# Altium schematic sheet 02_AFE.SchDoc
size Letter
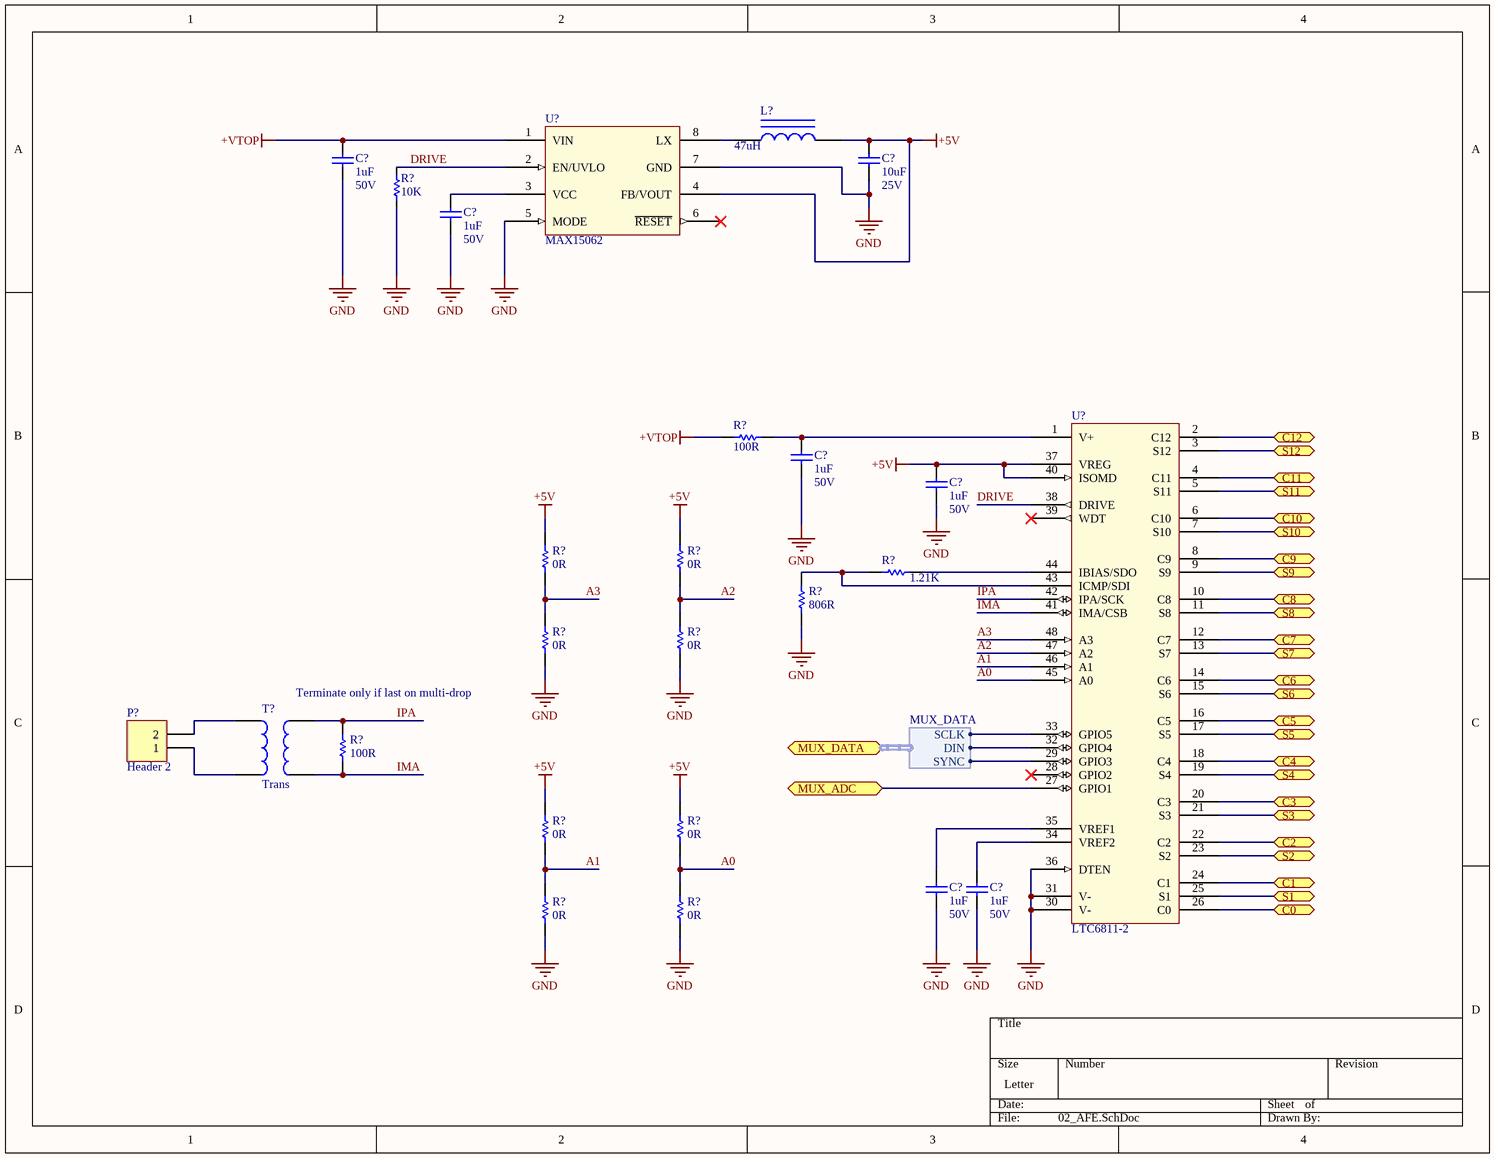
[diagram p0: 02_AFE.SchDoc]

## Parts
(Parts that share a designator on the sheet are numbered #1, #2 ... from top to bottom, then left to right.)
C?#1  1uF  Voltage: 50V  [CAPC1608X06N]
C?#2  10uF  Voltage: 25V  [CAPC1608X06N]
C?#3  1uF  Voltage: 50V  [CAPC1608X06N]
C?#4  1uF  Voltage: 50V  [CAPC1608X06N]
C?#5  1uF  Voltage: 50V  [CAPC1608X06N]
C?#6  1uF  Voltage: 50V  [CAPC1608X06N]
C?#7  1uF  Voltage: 50V  [CAPC1608X06N]
L?  value 47uH  [AXIAL-0.9]  (hidden comment: nductor Iron)
P?  Header 2  [HDR1X2]
R?#1  10K  [0805]
R?#2  value 100R  [AXIAL-0.3]  (hidden comment: Res1)
R?#3  value 0R  [AXIAL-0.3]  (hidden comment: Res1)
R?#4  value 0R  [AXIAL-0.3]  (hidden comment: Res1)
R?#5  value 1.21K  [AXIAL-0.3]  (hidden comment: Res1)
R?#6  value 806R  [AXIAL-0.3]  (hidden comment: Res1)
R?#7  value 0R  [AXIAL-0.3]  (hidden comment: Res1)
R?#8  value 0R  [AXIAL-0.3]  (hidden comment: Res1)
R?#9  value 100R  [AXIAL-0.3]  (hidden comment: Res1)
R?#10  value 0R  [AXIAL-0.3]  (hidden comment: Res1)
R?#11  value 0R  [AXIAL-0.3]  (hidden comment: Res1)
R?#12  value 0R  [AXIAL-0.3]  (hidden comment: Res1)
R?#13  value 0R  [AXIAL-0.3]  (hidden comment: Res1)
T?  Trans  [TRANS]
U?#1  MAX15062
U?#2  LTC6811-2

## Ports
C0, C1, C2, C3, C4, C5, C6, C7, C8, C9, C10, C11, C12, MUX_ADC, MUX_DATA (harness MUX_DATA), S1, S2, S3, S4, S5, S6, S7, S8, S9, S10, S11, S12

## Harnesses
MUX_DATA: SYNC, DIN, SCLK

## Nets
+5V: C?#2.2 C?#5.2 L?.2 R?#3.2 R?#4.2 R?#10.2 R?#11.2 U?#1.4(FB/VOUT) U?#2.37(VREG) U?#2.40(ISOMD)
+VTOP: C?#1.2 R?#2.2 U?#1.1(VIN)
GND: C?#1.1 C?#2.1 C?#3.1 C?#4.1 C?#5.1 C?#6.1 C?#7.1 R?#1.1 R?#6.1 R?#7.1 R?#8.1 R?#12.1 R?#13.1 U?#1.5(MODE) U?#1.7(GND) U?#2.30(V-) U?#2.31(V-) U?#2.36(DTEN)
A0: R?#11.1 R?#13.2 U?#2.45(A0)
A1: R?#10.1 R?#12.2 U?#2.46(A1)
A2: R?#4.1 R?#8.2 U?#2.47(A2)
A3: R?#3.1 R?#7.2 U?#2.48(A3)
C0: U?#2.26(C0) ; port C0
C1: U?#2.24(C1) ; port C1
C2: U?#2.22(C2) ; port C2
C3: U?#2.20(C3) ; port C3
C4: U?#2.18(C4) ; port C4
C5: U?#2.16(C5) ; port C5
C6: U?#2.14(C6) ; port C6
C7: U?#2.12(C7) ; port C7
C8: U?#2.10(C8) ; port C8
C9: U?#2.8(C9) ; port C9
C10: U?#2.6(C10) ; port C10
C11: U?#2.4(C11) ; port C11
C12: U?#2.2(C12) ; port C12
DRIVE: R?#1.2 U?#1.2(EN/UVLO) U?#2.38(DRIVE)
IMA: R?#9.1 T?.4 U?#2.41(IMA/CSB)
IPA: R?#9.2 T?.3 U?#2.42(IPA/SCK)
MUX_ADC: U?#2.27(GPIO1) ; port MUX_ADC
S1: U?#2.25(S1) ; port S1
S2: U?#2.23(S2) ; port S2
S3: U?#2.21(S3) ; port S3
S4: U?#2.19(S4) ; port S4
S5: U?#2.17(S5) ; port S5
S6: U?#2.15(S6) ; port S6
S7: U?#2.13(S7) ; port S7
S8: U?#2.11(S8) ; port S8
S9: U?#2.9(S9) ; port S9
S10: U?#2.7(S10) ; port S10
S11: U?#2.5(S11) ; port S11
S12: U?#2.3(S12) ; port S12
NetC?#3_2: C?#3.2 U?#1.3(VCC)
NetC?#4_2: C?#4.2 R?#2.1 U?#2.1(V+)
NetC?#6_2: C?#6.2 U?#2.35(VREF1)
NetC?#7_2: C?#7.2 U?#2.34(VREF2)
NetL?_1: L?.1 U?#1.8(LX)
NetP?_1: P?.1 T?.2
NetP?_2: P?.2 T?.1
NetR?#5_1: R?#5.1 U?#2.44(IBIAS/SDO)
NetR?#5_2: R?#5.2 R?#6.2 U?#2.43(ICMP/SDI)
NetU?#2_29: U?#2.29(GPIO3) ; port MUX_DATA.SYNC
NetU?#2_32: U?#2.32(GPIO4) ; port MUX_DATA.DIN
NetU?#2_33: U?#2.33(GPIO5) ; port MUX_DATA.SCLK

Not connected (* = marked no-connect by the designer): U?#1 6(~{RESET})*; U?#2 28(GPIO2)* 39(WDT)*

## Notes on the sheet
- Terminate only if last on multi-drop

## Library data of the parts
C?#1 C?#3-C?#7 = CAP CER 1UF 50V 10% X7R 0603: 1µF ±10% 50V Ceramic Capacitor X7R 0603 (1608 Metric); Manufacturer: Taiyo Yuden; ManufacturerPartNumber: UMK107AB7105KA-T; Value: 1uF; Supplier 1: Digi-Key; Supplier Part Number 1: 587-3247-1-ND
C?#2 = CAP CER 10uF 25V 20% X5R 0603: 10µF ±20% 25V Ceramic Capacitor X5R 0603 (1608 Metric); Manufacturer: Murata Electronics North America; ManufacturerPartNumber: GRM188R61E106MA73D; Value: 10uF; Supplier: Digi-Key; SupplierPartNumber: 490-7202-1-ND
L? = Inductor Iron: Magnetic-Core Inductor; Published: 24-Mar-1999; LatestRevisionDate: 17-Jul-2002; LatestRevisionNote: Re-released for DXP Platform.; PackageReference: AXIAL-0.9; Publisher: Altium Limited; PackageDescription: Axial Device, Thru-Hole; 2 Leads; 0.9 in Pin Spacing
P? = Header 2: Header, 2-Pin; LatestRevisionDate: 17-Jul-2002; LatestRevisionNote: Re-released for DXP Platform.; Publisher: Altium Limited
R?#1 = RES 10K OHM 1/8W 5% 0805 SMD: ManufacturerPartNumber: CRCW080510K0JNEA; Manufacturer: Vishay Dale; Value: 10K; Supplier: Digi-Key; SupplierPartNumber: 541-10KACT-ND; Supplier 1: Digi-Key
R?#2-R?#13 = Res1: Resistor; Published: 8-Jun-2000; LatestRevisionDate: 17-Jul-2002; LatestRevisionNote: Re-released for DXP Platform.; PackageReference: AXIAL-0.3; Publisher: Altium Limited; PackageDescription: Axial Device, Thru-Hole; 2 Leads; 0.3 in Pin Spacing
T? = Trans: Transformer; Published: 24-Mar-1999; LatestRevisionDate: 08-Jul-2005; LatestRevisionNote: Mech Layer 1 removed.; PackageReference: TRANS; Publisher: Altium Limited; PackageDescription: Transformer; 4 Leads
U?#1 = IC_REG_MAX15062: IC REG BUCK 5V 0.3A SYNC 8-TDFN; Manufacturer: Maxim Integrated; Manufacturer Part Number: MAX15062BATA+T; Digikey Part Number: MAX15062BATA+TCT-ND
U?#2 = IC_AFE_LTC6811-2: IC MONITOR BATT STACK 48SSOP; Manufacturer: Linear Technology; Manufacturer Part Number: LTC6811HG-2#PBF; Digikey Part Number: LTC6811HG-2#PBF-ND